# Altium schematic sheet RST100UF25V0041_RST100UF25V004.schdoc.schdoc
size 127 x 99 mm
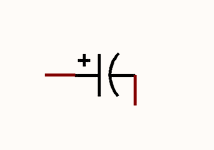
[diagram p0: RST100UF25V0041_RST100UF25V004.schdoc.schdoc]

## Parts
U?  RST100UF25V004  [CAP-SMD_BD6.3-L6.6-W6.6-LS7.3-FD]  (value not drawn)

## Nets

Not connected (* = marked no-connect by the designer): U? 1 2

## Library data of the parts
U? = RST100UF25V004: Manufacturer: KNSCHA(科尼盛); Add into BOM: yes; Value: 100uF; Tolerance: ±20%; Rated Voltage: 25V; Ripple Current: 88mA@120Hz; φD: 6.3mm; L: 5.4mm; Lifetime @ Temp: 2000hrs@105℃; Symbol: RST100UF25V004; Device: RST100UF25V004; LCSC Part Name: 100uF ±20% 25V; Supplier Part: C4747964; Manufacturer Part: RST100UF25V004; Supplier Footprint: SMD,D6.3xL5.4mm; JLCPCB Part Class: Extended Part; Datasheet: https://atta.szlcsc.com/upload/public/pdf/source/20220722/52F6C209ACF875FF59C64C72CE2329EE.pdf; Supplier: LCSC; Convert to PCB: yes; Equivalent Series Resistance(ESR): -; Operating Temperature: -40℃~+105℃